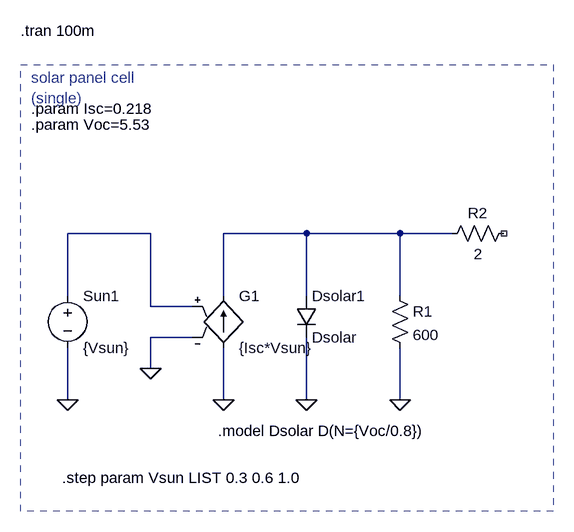
[diagram p0: schematic single_cell.asc]
single_cell.asc, the LTspice schematic file:
Version 4
SHEET 1 880 688
WIRE 256 256 128 256
WIRE 496 256 368 256
WIRE 640 256 496 256
WIRE 720 256 640 256
WIRE 128 352 128 256
WIRE 368 352 368 256
WIRE 496 352 496 256
WIRE 640 352 640 256
WIRE 256 368 256 256
WIRE 320 368 256 368
WIRE 320 416 256 416
WIRE 256 464 256 416
WIRE 128 512 128 432
WIRE 368 512 368 432
WIRE 496 512 496 416
WIRE 640 512 640 432
FLAG 128 512 0
FLAG 496 512 0
FLAG 640 512 0
FLAG 368 512 0
FLAG 256 464 0
SYMBOL voltage 128 336 R0
SYMATTR InstName Sun1
SYMATTR Value {Vsun}
SYMBOL Diode 480 352 R0
SYMATTR InstName Dsolar1
SYMATTR Value Dsolar
SYMBOL Res 624 336 R0
SYMATTR InstName R1
SYMATTR Value 600
SYMBOL Res 816 240 R90
WINDOW 0 0 56 VBottom 2
WINDOW 3 32 56 VTop 2
SYMATTR InstName R2
SYMATTR Value 2
SYMBOL g 368 336 R0
SYMATTR InstName G1
SYMATTR Value {Isc*Vsun}
TEXT 72 16 Left 2 ;solar panel cell\n(single)
TEXT 120 632 Left 2 !.step param Vsun LIST 0.3 0.6 1.0
TEXT 360 560 Left 2 !.model Dsolar D(N={Voc/0.8})
TEXT 72 64 Left 2 !.param Isc=0.218
TEXT 72 88 Left 2 !.param Voc=5.53
TEXT 56 -56 Left 2 !.tran 100m
RECTANGLE Normal 56 -4 876 684 2

The netlist it stands for:
* single_cell.asc
V§Sun1 N001 0 {Vsun}
Dsolar1 N002 0 Dsolar
R1 N002 0 600
R2 NC_01 N002 2
G1 0 N002 N001 0 {Isc*Vsun}
.model D D
.lib standard.dio
* solar panel cell
* (single)
.step param Vsun LIST 0.3 0.6 1.0
.model Dsolar D(N={Voc/0.8})
.param Isc=0.218
.param Voc=5.53
.tran 100m
.backanno
.end